# EAGLE design Dual-VCA (EAGLE 9.6.2)
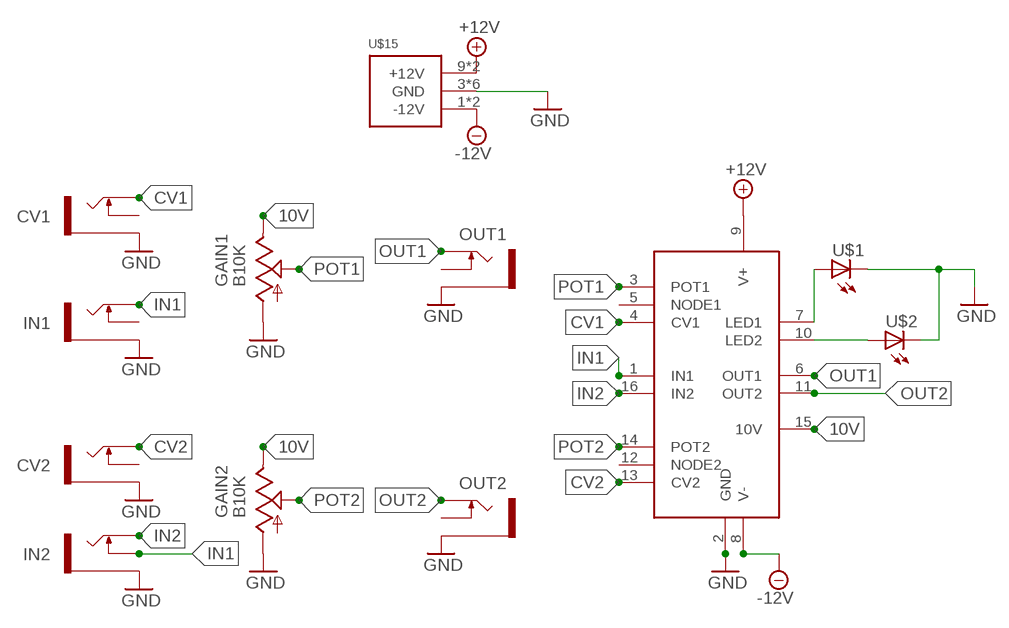
[diagram p0: schematic, sheet 1]

## Parts
CV1  THONKICONN-SOCKETS-PJ301M-12NEW  [THONKICONN-SOCKETS-PJ301M-12]
CV2  THONKICONN-SOCKETS-PJ301M-12NEW  [THONKICONN-SOCKETS-PJ301M-12]
GAIN1  B10K  MUSICTHINGMODULAR_9MM_SNAP-IN_POT_  [MUSICTHINGMODULAR_9MM_SNAP-IN_POT]
GAIN2  B10K  MUSICTHINGMODULAR_9MM_SNAP-IN_POT_  [MUSICTHINGMODULAR_9MM_SNAP-IN_POT]
IN1  THONKICONN-SOCKETS-PJ301M-12NEW  [THONKICONN-SOCKETS-PJ301M-12]
IN2  THONKICONN-SOCKETS-PJ301M-12NEW  [THONKICONN-SOCKETS-PJ301M-12]
OUT1  THONKICONN-SOCKETS-PJ301M-12NEW  [THONKICONN-SOCKETS-PJ301M-12]
OUT2  THONKICONN-SOCKETS-PJ301M-12NEW  [THONKICONN-SOCKETS-PJ301M-12]
U1  ES_2164_V2  [ES_2164_V2]
U$1  LED3MM  [LED3MM]
U$2  LED3MM  [LED3MM]
U$15  POWER_SIMPLE10  [POWER_10]

## Nets
10V: GAIN1.3(E) GAIN2.3(E) U1.15(10V)
+12V [POWER]: U1.9(V+) U$15.9(+12V) U$15.10(+12V)
-12V [POWER]: U1.8(V-) U$15.1(-12V) U$15.2(-12V)
CV1: CV1.P$1_TIP(TIP) U1.4(CV1)
CV2: CV2.P$1_TIP(TIP) U1.13(CV2)
GND: CV1.P$3_SLEEVE(SLEEVE) CV2.P$3_SLEEVE(SLEEVE) GAIN1.1(A) GAIN2.1(A) IN1.P$3_SLEEVE(SLEEVE) IN2.P$3_SLEEVE(SLEEVE) OUT1.P$3_SLEEVE(SLEEVE) OUT2.P$3_SLEEVE(SLEEVE) U1.2(GND) U$1.K(C) U$2.K(C) U$15.3(GND) U$15.4(GND) U$15.5(GND) U$15.6(GND) U$15.7(GND) U$15.8(GND)
IN1: IN1.P$1_TIP(TIP) IN2.P$2_SWITCH(SWITCH) U1.1(IN1)
IN2: IN2.P$1_TIP(TIP) U1.16(IN2)
N$1: U1.7(LED1) U$1.A
N$2: U1.10(LED2) U$2.A
OUT1: OUT1.P$1_TIP(TIP) U1.6(OUT1)
OUT2: OUT2.P$1_TIP(TIP) U1.11(OUT2)
POT1: GAIN1.2(S) U1.3(POT1)
POT2: GAIN2.2(S) U1.14(POT2)
Unconnected: CV1.P$2_SWITCH(SWITCH) CV2.P$2_SWITCH(SWITCH) IN1.P$2_SWITCH(SWITCH) OUT1.P$2_SWITCH(SWITCH) OUT2.P$2_SWITCH(SWITCH) U1.5(NODE1) U1.12(NODE2)

## Library data of the parts
CV1 = EURACK-MASTER-LIB:THONKICONN-SOCKETS-PJ301M-12: 3.5mm socket for Eurorack modular synths These are the Thonk sockets Thonkicon old and new. Thonkiconn (PJ301M-12) is a new vertical mount 3.5mm switching mono phone jack. The mechanism is identical to the ‘Erthenvar’ jack type (PJ301BM), it’s primary purpose is as a direct replacement of the popular Kobiconn 3.5mm jack but with a 100% vertically integrated footprint, i.e. no perpendicular ground pin. A really great bonus of these parts is they fit neatly into breadboard/stripboard/veroboard.; USE: CV1
CV2 = EURACK-MASTER-LIB:THONKICONN-SOCKETS-PJ301M-12: 3.5mm socket for Eurorack modular synths These are the Thonk sockets Thonkicon old and new. Thonkiconn (PJ301M-12) is a new vertical mount 3.5mm switching mono phone jack. The mechanism is identical to the ‘Erthenvar’ jack type (PJ301BM), it’s primary purpose is as a direct replacement of the popular Kobiconn 3.5mm jack but with a 100% vertically integrated footprint, i.e. no perpendicular ground pin. A really great bonus of these parts is they fit neatly into breadboard/stripboard/veroboard.; USE: CV2
GAIN1 GAIN2 = ES-2144 LPF Module:MUSICTHINGMODULAR_9MM_SNAP-IN_POT: 9mm vertical snap-in pot, Alpha / Panasonic style
IN1 = EURACK-MASTER-LIB:THONKICONN-SOCKETS-PJ301M-12: 3.5mm socket for Eurorack modular synths These are the Thonk sockets Thonkicon old and new. Thonkiconn (PJ301M-12) is a new vertical mount 3.5mm switching mono phone jack. The mechanism is identical to the ‘Erthenvar’ jack type (PJ301BM), it’s primary purpose is as a direct replacement of the popular Kobiconn 3.5mm jack but with a 100% vertically integrated footprint, i.e. no perpendicular ground pin. A really great bonus of these parts is they fit neatly into breadboard/stripboard/veroboard.; USE: IN1
IN2 = EURACK-MASTER-LIB:THONKICONN-SOCKETS-PJ301M-12: 3.5mm socket for Eurorack modular synths These are the Thonk sockets Thonkicon old and new. Thonkiconn (PJ301M-12) is a new vertical mount 3.5mm switching mono phone jack. The mechanism is identical to the ‘Erthenvar’ jack type (PJ301BM), it’s primary purpose is as a direct replacement of the popular Kobiconn 3.5mm jack but with a 100% vertically integrated footprint, i.e. no perpendicular ground pin. A really great bonus of these parts is they fit neatly into breadboard/stripboard/veroboard.; USE: IN2
OUT1 = EURACK-MASTER-LIB:THONKICONN-SOCKETS-PJ301M-12: 3.5mm socket for Eurorack modular synths These are the Thonk sockets Thonkicon old and new. Thonkiconn (PJ301M-12) is a new vertical mount 3.5mm switching mono phone jack. The mechanism is identical to the ‘Erthenvar’ jack type (PJ301BM), it’s primary purpose is as a direct replacement of the popular Kobiconn 3.5mm jack but with a 100% vertically integrated footprint, i.e. no perpendicular ground pin. A really great bonus of these parts is they fit neatly into breadboard/stripboard/veroboard.; USE: OUT1
OUT2 = EURACK-MASTER-LIB:THONKICONN-SOCKETS-PJ301M-12: 3.5mm socket for Eurorack modular synths These are the Thonk sockets Thonkicon old and new. Thonkiconn (PJ301M-12) is a new vertical mount 3.5mm switching mono phone jack. The mechanism is identical to the ‘Erthenvar’ jack type (PJ301BM), it’s primary purpose is as a direct replacement of the popular Kobiconn 3.5mm jack but with a 100% vertically integrated footprint, i.e. no perpendicular ground pin. A really great bonus of these parts is they fit neatly into breadboard/stripboard/veroboard.; USE: OUT2
U1 = Electrosmith_Boards:ES_2164_V2: Designed for ES_2164_Rev4
U$1 U$2 = zlob:LED
U$15 = russ_eurorack:POWER_SIMPLE

## Net classes
0 default: width 0.203 mm
1 POWER: width 0.406 mm

## Board
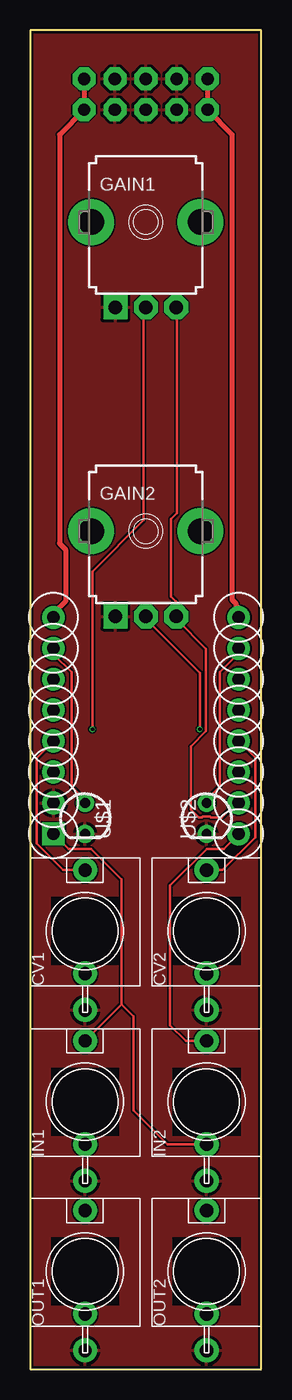
[diagram p1: board, top side]
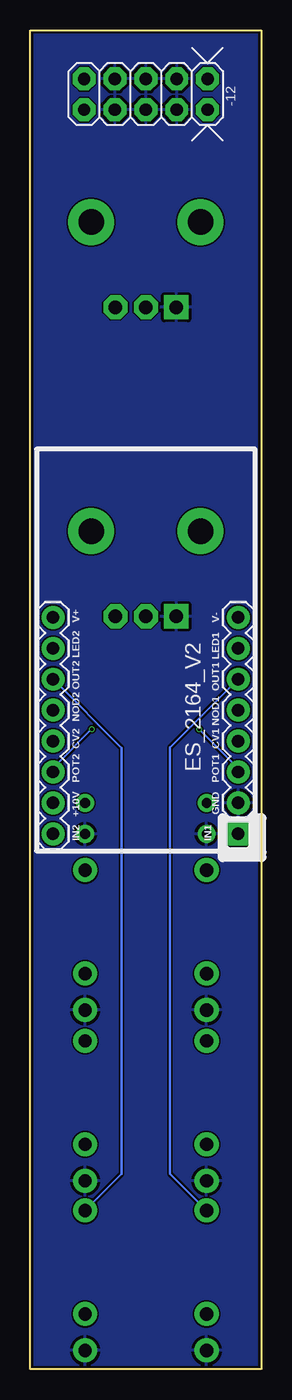
[diagram p2: board, bottom side, seen from below]

Size 19 x 110 mm. Coordinates in mm from the lower left corner, seen from the top.
Outline: 0,0 19,0 19,110 0,110 0,0
Copper layers (1*16): Top 0.035mm / dielectric 1.6mm / Bottom 0.035mm
Design rules "jlcpcb-2layers": minimum track width 5mil, minimum drill 0.3mm, track to track 5mil, track to pad 5mil, pad to pad 5mil, via to via 5mil, smd to smd 5mil, copper to edge 0.2mm, drill to drill 6mil, minimum pad ring 10mil, minimum via ring 3mil, stop-mask expansion 4mil, vias tented up to drill 0mil, thermal gap 10mil

### Footprints (pad centres in the part's own frame; a part is rotated, then mirrored left to right if it is on the bottom)
THONKICONN-SOCKETS-PJ301M-12 = drill 1.1: P$1_TIP 0,5; P$2_SWITCH 0,-3.5; P$3_SLEEVE 0,-6.5
MUSICTHINGMODULAR_9MM_SNAP-IN_POT = drill 1.1 square: 1 -2.5,-7 | drill 1.1 octagon: 2 0,-7; 3 2.5,-7 | drill 2.1 pad 2.794: CHASSIS1 -4.5,0; CHASSIS2 4.5,0
ES_2164_V2 = drill 1.016 pad 1.88 square: 1 1.395,1.395 | drill 1.016 pad 1.88: 2 3.935,1.395; 3 6.475,1.395; 4 9.015,1.395; 5 11.555,1.395; 6 14.095,1.395; 7 16.635,1.395; 8 19.175,1.395; 9 19.175,16.635; 10 16.635,16.635; 11 14.095,16.635; 12 11.555,16.635; 13 9.015,16.635; 14 6.475,16.635; 15 3.935,16.635; 16 1.395,16.635
LED3MM = drill 0.813: A -1.27,0; K 1.27,0
POWER_10 = drill 1.016 pad 1.88 octagon: 1 -5.08,-1.27; 2 -5.08,1.27; 3 -2.54,-1.27; 4 -2.54,1.27; 5 0,-1.27; 6 0,1.27; 7 2.54,-1.27; 8 2.54,1.27; 9 5.08,-1.27; 10 5.08,1.27

### Placement (x,y rotation side)
CV1  4.5,36 0 top
CV2  14.5,36 0 top
GAIN1  9.5,94.25 0 top
GAIN2  9.5,68.86 0 top
IN1  4.5,21.97 0 top
IN2  14.5,21.97 0 top
OUT1  4.5,8.03 0 top
OUT2  14.5,8.03 0 top
U1  0.5,42.59 90 bottom
U$1  4.5,45.25 270 top
U$2  14.5,45.25 270 top
U$15  9.5,104.75 180 bottom

### Tracks (layer width: path | path; a pad name or v marks a point on that pad's centre or on a via)
10V
  Top 0.203: U1.15 17.08,46.47 16.92,46.47 15.76,45.32 14.85,45.32 14.77,45.4 14.19,45.4 14.11,45.32 13.86,45.32 13.2,45.98 13.2,51.18 14.44,52.41 14.44,59.18 12.05,61.58 12.05,61.83 GAIN2.3 11.96,61.91 11.96,63.06 11.55,63.48 11.55,69.83 12.05,70.33 12.05,87.25 GAIN1.3
+12V
  Top 0.406: U1.9 17.08,61.83 17.08,62.57 16.92,62.73 16.92,62.9 16.59,63.23 16.59,101.45 14.61,103.43 U$15.10 14.61,103.68 14.61,105.99 U$15.9
-12V
  Top 0.406: U1.8 1.98,61.83 1.98,62.16 2.88,63.06 2.88,67.36 2.39,67.85 2.39,101.45 4.37,103.43 U$15.2 4.45,103.68 4.45,105.99 U$15.1
CV1
  Top 0.203: U1.4 0.5,50.21 0.5,43.18 2.68,41 CV1.P$1_TIP
CV2
  Top 0.203: U1.13 18.49,50.25 18.5,50.25 18.5,43.7 15.8,41 CV2.P$1_TIP
GND
  pour Top: -0.5,-0.36 19.82,-0.36 19.82,110.13 -0.5,110.13
  pour Bottom: -0.5,-0.36 19.82,-0.36 19.82,110.13 -0.5,110.13
IN1
  Top 0.203: U1.1 3.13,42.75 5,42.75 7.5,40.25 7.5,29.97 | 7.5,29.97 IN1.P$1_TIP | IN2.P$2_SWITCH 11.28,18.47 8.5,21.25 8.5,28.97 7.5,29.97
IN2
  Top 0.203: U1.16 15.9,42.75 14.53,42.75 11.5,39.72 11.5,28.25 12.78,26.97 IN2.P$1_TIP
N$1
  Top 0.203: U$1.A 4.45,46.55 4.45,46.8 3.38,47.88 3.38,57.28 1.98,58.69 1.98,59.18 U1.7
N$2
  Top 0.203: U$2.A 14.52,46.55 14.52,46.8 15.6,47.88 15.6,57.28 17.08,58.77 17.08,59.18 U1.10
OUT1
  Bottom 0.203: OUT1.P$1_TIP 7.5,16.03 7.5,51.08 U1.6
OUT2
  Bottom 0.203: U1.11 11.5,51.05 11.5,16.03 OUT2.P$1_TIP
POT1  (via drill 0.3)
  Top 0.203: v5.11,52.58 5.11,65.54 9.32,69.75 9.32,87.09 GAIN1.2
  Bottom 0.203: v5.11,52.58 1.98,49.44 1.98,49.11 U1.3
POT2  (via drill 0.3)
  Top 0.203: v13.95,52.58 13.95,57.2 9.57,61.58 9.57,61.83 GAIN2.2
  Bottom 0.203: v13.95,52.58 17.08,49.44 17.08,49.11 U1.14